# Altium schematic sheet TPIC8101DW.SchDoc
size A4; SheetNumber: 3; SheetTotal: 8; SPICEModelCacheOGXEDZQU: <root> / <DocumentId>OGXEDZQU</DocumentId> / <CacheFrame Number="0"> / <Model Name="xtal" Kind="CKT"> / <Text>*Generic type:crystal pkg:HC33/51 / .SUBCKT XTAL 1 2 PARAMS: FREQ=1Meg RS=750 C=13pf Q=1000 / LX 1 3 {((Q*RS)/(6.2831852*FREQ))} IC=0.5M / CX 3 4 {(1/(Q*6.2831852*FREQ*RS))} / C0 1 2 {C} / RS 4 2 {RS} / .ENDS XTAL</Text> / </Model> / </CacheFrame> / </root>
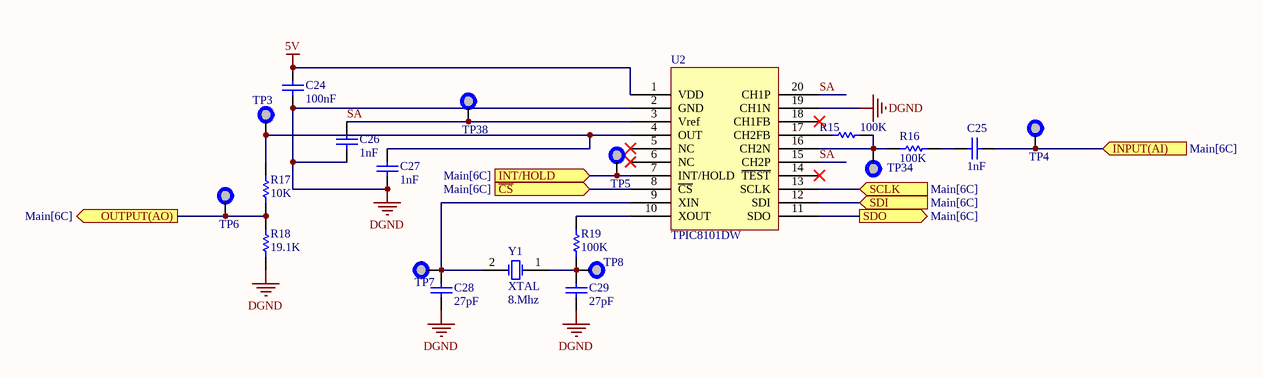
[diagram p0: TPIC8101DW.SchDoc]

## Parts
C24  100nF  [0603c]
C25  1nF  [0805C]
C26  1nF  [0805C]
C27  1nF  [0805C]
C28  value 27pF  [0805C]  (hidden comment: 1nF)
C29  27pF  [0805C]
R15  100K  [0805]
R16  100K  [0805]
R17  10K  [0805]
R18  19.1K  [0805]
R19  100K  [0805]
TP3  TestPoint  [TP]  (value not drawn)
TP4  TestPoint  [TP]  (value not drawn)
TP5  TestPoint  [TP]  (value not drawn)
TP6  TestPoint  [TP]  (value not drawn)
TP7  TestPoint  [TP]  (value not drawn)
TP8  TestPoint  [TP]  (value not drawn)
TP34  TestPoint  [TP]  (value not drawn)
TP38  TestPoint  [TP]  (value not drawn)
U2  TPIC8101DW  [SOIC-20]
Y1  XTAL  value 8.Mhz  [XTAL]

## Ports
INPUT(AI) (in, see Main[6C]), INT/HOLD (in, see Main[6C]), OUTPUT(AO) (out, see Main[6C]), SCLK (in, see Main[6C]), SDI (in, see Main[6C]), SDO (out, see Main[6C]), ~{CS} (in, see Main[6C])

## Nets
5V: C24.1 U2.1(VDD)
DGND: C24.2 C26.1 C27.1 C28.2 C29.2 R18.1 U2.2(GND) U2.19(CH1N)
~{CS}: U2.8(~{CS}) ; port ~{CS}
INPUT(AI): C25.1 TP4.1 ; port INPUT(AI)
INT/HOLD: TP5.1 U2.7(INT/HOLD) ; port INT/HOLD
OUTPUT(AO): R17.1 R18.2 TP6.1 ; port OUTPUT(AO)
SA: C26.2 TP38.1 U2.3(Vref) U2.15(CH2P) U2.20(CH1P)
SCLK: U2.13(SCLK) ; port SCLK
SDI: U2.12(SDI) ; port SDI
SDO: U2.11(SDO) ; port SDO
NetC25_2: C25.2 R16.2
NetC27_2: C27.2 R17.2 TP3.1 U2.4(OUT)
NetC28_1: C28.1 TP7.1 U2.9(XIN) Y1.2(OSC2)
NetC29_1: C29.1 R19.1 TP8.1 Y1.1(OSC1)
NetR15_1: R15.1 U2.17(CH2FB)
NetR15_2: R15.2 R16.1 TP34.1 U2.16(CH2N)
NetR19_2: R19.2 U2.10(XOUT)

Not connected (* = marked no-connect by the designer): U2 5(NC)* 6(NC)* 14(~{TEST})* 18(CH1FB)*

## Library data of the parts
C24-C29 = Cap: LOW ESR; Published: 8-Jun-2000; LatestRevisionDate: 17-Jul-2002; LatestRevisionNote: Re-released for DXP Platform.; PackageReference: RAD-0.3; Publisher: Altium Limited; PackageDescription: Radial Cap, Thru-Hole; 2 Leads; 0.3 in Pin Spacing
  C24: Value: 100nF
  C25-C27: Value: 1nF
  C29: Value: 27pF
R15-R19 = Res1: Resistor; Published: 8-Jun-2000; LatestRevisionDate: 17-Jul-2002; LatestRevisionNote: Re-released for DXP Platform.; PackageReference: AXIAL-0.3; Publisher: Altium Limited; PackageDescription: Axial Device, Thru-Hole; 2 Leads; 0.3 in Pin Spacing
  R15 R16 R19: Value: 100K
  R17: Value: 10K
  R18: Value: 19.1K
U2 = TPIC8101DW: Knock, SO20; Manufacturer: TI; Code: 301; Part Number: TPIC8101DW; Type: Knock Sensor Interface; Features: Dual-Channel Knock Sensor Interface; Package: SO20
Y1 = XTAL: Crystal Oscillator; Published: 8-Jun-2000; LatestRevisionDate: 17-Jul-2002; LatestRevisionNote: Re-released for DXP Platform.; PackageReference: R38; Publisher: Altium Limited; PackageDescription: Crystal, Thru-Hole; 2 Leads; Body 3.1 x 8.2 mm (Dia.xH)